# Altium project CW312T_ICE40UP.PrjPcb
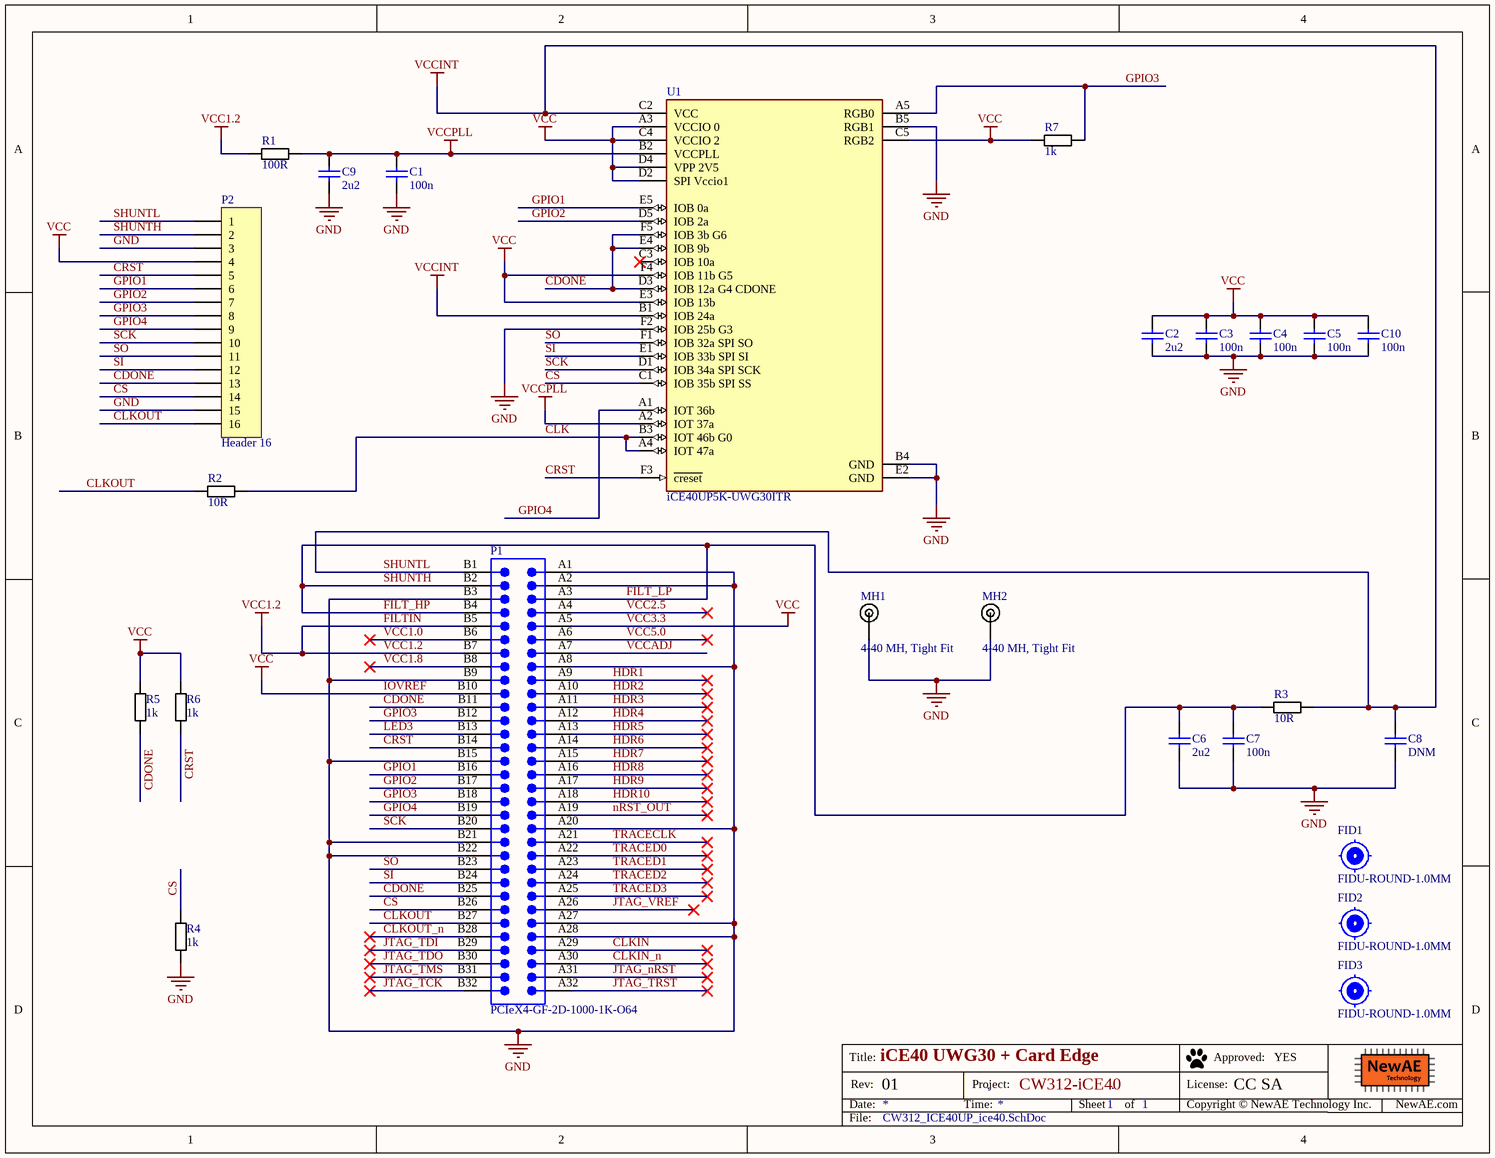
[diagram p0: CW312_ICE40UP_ice40.SchDoc]
PrjLicense: CC SA; PrjName: CW312-iCE40; PrjRev: 01
1 sheet, 25 parts. Net scope: global (net labels, ports and power ports of the same name join across sheets).
Board file: CW312T_ICE40UP.PcbDoc

## Sheet CW312_ICE40UP_ice40.SchDoc: iCE40 UWG30 + Card Edge
size Letter; Organization: NewAE Technology Inc.; Address1: 1083 Queen St., Suite 196; Address2: Halifax; Address3: NS; Address4: Canada B3H 0B2; DocumentNumber: .; Revision: .; SheetNumber: 1; SheetTotal: 1; SheetApproved: YES

### Parts
C1  100n  [CAPC0603_M]
C2  2u2  [CAPC0603_M]
C3  100n  [CAPC0603_M]
C4  100n  [CAPC0603_M]
C5  100n  [CAPC0603_M]
C6  2u2  [CAPC0603_M]
C7  100n  [CAPC0603_M]
C8  DNM  [CAPC0603_M]
C9  2u2  [CAPC0603_M]
C10  100n  [CAPC0603_M]
FID1  FIDU-ROUND-1.0MM  [FIDU-ROUND-1.0mm]  (no BOM)
FID2  FIDU-ROUND-1.0MM  [FIDU-ROUND-1.0mm]  (no BOM)
FID3  FIDU-ROUND-1.0MM  [FIDU-ROUND-1.0mm]  (no BOM)
MH1  4-40 MH, Tight Fit  [MOUNT_#4_TIGHT]
MH2  4-40 MH, Tight Fit  [MOUNT_#4_TIGHT]
P1  PCIeX4-GF-2D-1000-1K-O64  [PCIeX4-GF-2D-1000-1K-O64]  (no BOM)
P2  Header 16  [HDR1X16]
R1  100R  [RESC1608X55N]
R2  10R  [RESC1608X55N]
R3  10R  [RESC1608X55N]
R4  1k  [RESC1608X55N]
R5  1k  [RESC1608X55N]
R6  1k  [RESC1608X55N]
R7  1k  [RESC1608X55N]
U1  iCE40UP5K-UWG30ITR  [FP-WLSC-30-MFG]

### Nets
FILTIN: P1.B5 P1.B7 R1.1  [also labelled VCC1.2]
GND: C1.2 C2.2 C3.2 C4.2 C5.2 C6.2 C7.2 C8.2 C9.2 C10.2 MH1.1 MH2.1 P1.A1 P1.A2 P1.A8 P1.A20 P1.A27 P1.A28 P1.B3 P1.B9 P1.B15 P1.B21 P1.B22 P2.3 P2.15 R4.1 U1.B4(GND) U1.B5(RGB1) U1.E2(GND) U1.F2(IOB_25b_G3)
IOVREF: C2.1 C3.1 C4.1 C5.1 C10.1 P1.A5 P1.B10 P2.4 R5.1 R6.1 R7.2 U1.A3(VCCIO_0) U1.C4(VCCIO_2) U1.C5(RGB2) U1.D2(SPI_Vccio1) U1.D4(VPP_2V5) U1.E3(IOB_13b) U1.F4(IOB_11b_G5)  [also labelled VCC, VCC3.3]
SHUNTL: C8.1 P1.B1 P2.1 R3.2 U1.B1(IOB_24a) U1.C2(VCC)  [also labelled VCCINT]
VCCPLL: C1.1 C9.1 R1.2 U1.A2(IOT_37a) U1.B2(VCCPLL)
CDONE: P1.B11 P1.B25 P2.13 R5.2 U1.D3(IOB_12a_G4_CDONE) U1.E4(IOB_9b) U1.F5(IOB_3b_G6)
CLK: R2.1 U1.A4(IOT_47a) U1.B3(IOT_46b_G0)
CLKIN: P1.A29
CLKIN_n: P1.A30
CLKOUT: P1.B27 P2.16 R2.2
CLKOUT_n: P1.B28
CRST: P1.B14 P2.5 R6.2 U1.F3(~{creset})
CS: P1.B26 P2.14 R4.2 U1.C1(IOB_35b_SPI_SS)
FILT_HP: C6.1 C7.1 P1.A3 P1.B2 P1.B4 P2.2 R3.1  [also labelled FILT_LP, SHUNTH]
GPIO1: P1.B16 P2.6 U1.E5(IOB_0a)
GPIO2: P1.B17 P2.7 U1.D5(IOB_2a)
GPIO3: P1.B12 P1.B18 P2.8 R7.1 U1.A5(RGB0)
GPIO4: P1.B19 P2.9 U1.A1(IOT_36b)
HDR1: P1.A9
HDR2: P1.A10
HDR3: P1.A11
HDR4: P1.A12
HDR5: P1.A13
HDR6: P1.A14
HDR7: P1.A15
HDR8: P1.A16
HDR9: P1.A17
HDR10: P1.A18
JTAG_nRST: P1.A31
JTAG_TCK: P1.B32
JTAG_TDI: P1.B29
JTAG_TDO: P1.B30
JTAG_TMS: P1.B31
JTAG_TRST: P1.A32
JTAG_VREF: P1.A26
LED3: P1.B13
nRST_OUT: P1.A19
SCK: P1.B20 P2.10 U1.D1(IOB_34a_SPI_SCK)
SI: P1.B24 P2.12 U1.E1(IOB_33b_SPI_SI)
SO: P1.B23 P2.11 U1.F1(IOB_32a_SPI_SO)
TRACECLK: P1.A21
TRACED0: P1.A22
TRACED1: P1.A23
TRACED2: P1.A24
TRACED3: P1.A25
VCC1.0: P1.B6
VCC1.8: P1.B8
VCC2.5: P1.A4
VCC5.0: P1.A6
VCCADJ: P1.A7

Not connected (* = marked no-connect by the designer): U1 C3(IOB_10a)*

### Notes on the sheet
- Title:
- Date:
- Rev:
- Time:
- Project:
- Sheet
- of
- License:
- Copyright © NewAE Technology Inc.
- Approved:
- NewAE.com
- File:

### Library data of the parts
C1 C3-C5 C7 C10 = CCHIP-100n-0603: 100n, 0603; Manufacture 1: Kemet; Manufacture Part Number 1: C0603C104K5RACTU; Component Group: Capacitor; Case-EIA: 0603; Case-Metric: 1608; Rated Voltage: 50VDC; Part Number: CCHIP-100n-0603; Footprint: 0603; Pin Count: 2; Supplier 1: Digi-Key; Supplier Part Number 1: 399-5089-2-ND; Value: 100n; Mounting Technology: SMT; Component Kind: Standard; Component Type: Standard
C2 C6 C9 = CCHIP-2u2-0603: 2u2, 0603; Manufacture 1: Samsung; Manufacture Part Number 1: CL10B225KP8NNNC; Component Group: Capacitor; Case-EIA: 0603; Case-Metric: 1608; Rated Voltage: 10VDC; Part Number: CCHIP-2u2-0603; Footprint: 0603; Pin Count: 2; Supplier 1: Digi-Key; Supplier Part Number 1: 1276-1134-1-ND; Value: 2u2; Mounting Technology: SMT; Component Kind: Standard; Component Type: Standard
C8 = CCHIP-DNM-0603: DNM, 0603; Component Group: Capacitor; Case-EIA: 0603; Part Number: CCHIP-DNM-0603; Footprint: 0603; Pin Count: 2; Value: DNM; Mounting Technology: SMT; Component Kind: Standard; Component Type: Standard
FID1-FID3 = FIDU-ROUND-1.0MM: ROUND FIDUCIAL; Component Group: PCB Feature; Part Number: FIDU-ROUND-1.0MM; Pin Count: 0; Component Type: Standard (No BOM)
MH1 MH2 = MOUNT_#4_TIGHT: Machine screw 4-40 Mounting Hole; Component Group: Mechanical; PP Material Stack: 0; Part Number: MOUNT_#4_TIGHT; Pin Count: 1; Component Kind: Mechanical; Component Type: Mechanical; PP Rotation: 0
P1 = CMP-0001-00031-2: Golden finger, PCIeX4, Dual, Opposite, Pitch 1mm, 64-Position; Mating Connector: Molex-87715-9106; Publisher: Altium; ClassName: Edge Connector; Datasheet Version: rev2.0, Apr-2007; Package Reference: PCIeX4-GF-2D-1000-1K-O64
P2 = Header 16: Header, 16-Pin; LatestRevisionDate: 17-Jul-2002; LatestRevisionNote: Re-released for DXP Platform.; Publisher: Altium Limited
R1 = RCHIP-100R-0603: 100R res, 0603, 1%, 1/10W; Manufacture 1: Yageo; Manufacture Part Number 1: RC0603FR-07100RL; Component Group: Resistor; Case-EIA: 0603; Case-Metric: 1608; Rated Power: 0.1W; Rated Voltage: 75VDC; Part Number: RCHIP-100R-0603; Footprint: 0603; Pin Count: 2; Supplier 1: Digi-Key; Supplier Part Number 1: 311-100HRCT-ND; Value: 100R; Tolerance: 1%; Mounting Technology: SMT; Temperature Range: -55C to 155C; Component Kind: Standard; Component Type: Standard
R2 R3 = RCHIP-10R-0603: 10R res, 0603, 1%, 1/10W; Manufacture 1: Yageo; Manufacture Part Number 1: RC0603FR-0710RL; Component Group: Resistor; Case-EIA: 0603; Case-Metric: 1608; Rated Power: 0.1W; Rated Voltage: 75VDC; Part Number: RCHIP-10R-0603; Footprint: 0603; Pin Count: 2; Supplier 1: Digi-Key; Supplier Part Number 1: 311-10.0HRCT-ND; Value: 10R; Tolerance: 1%; Mounting Technology: SMT; Temperature Range: -55C to 155C; Component Kind: Standard; Component Type: Standard
R4-R7 = RCHIP-1K-0603: 1k res, 0603, 1%, 1/10W; Manufacture 1: Yageo; Manufacture Part Number 1: RC0603FR-071KL; Component Group: Resistor; Case-EIA: 0603; Case-Metric: 1608; Rated Power: 0.1W; Rated Voltage: 75VDC; Part Number: RCHIP-1K-0603; Footprint: 0603; Pin Count: 2; Supplier 1: Digi-Key; Supplier Part Number 1: 311-1.00KHRCT-ND; Value: 1k; Tolerance: 1%; Mounting Technology: SMT; Temperature Range: -55C to 155C; Component Kind: Standard; Component Type: Standard
U1 = CMP-17932-000002-1: CE40-ULTRAPLUS, 5280 LUTS, 1.2V; Manufacturer: Lattice Semiconductor; Frequency: 185MHz; Max Junction Temp: +100°C; Propagation Delay: 9ns; Min Supply Voltage: 1.14V; Standoff Height: 0.14mm; Number Of I/Os: 21; Ram Size: 1024Kbits; Number Of Logic Blocks: 660; Max Supply Voltage: 3.46V; Number Of Logic Elements Cells: 5280; ComponentLink2URL: http://www.latticesemi.com/view_document?document_id=51968; Manufacturer Part Number: iCE40UP5K-UWG30ITR; Device Class L2: Embedded Processors and Controllers; Automotive: No; Octopart: https://octopart.com/ice40up5k-uwg30itr-lattice+semiconductor-75367085; Category: IC; Ipc Land Pattern Name: BGA30N40P5X6_253X211X60; Device Class L3: FPGAs - Field Programmable Gate Arrays; Device Class L1: Integrated Circuits (ICs); Digikey Description: CE40-ULTRAPLUS, 5280 LUTS, 1.2V; Temperature: -40°C to +100°C; Temperature Range Low: -40°C; Lead Free: Yes; Footprint Url: http://www.latticesemi.com/view_document?document_id=213; Height: 0.6mm; Temperature Range High: +100°C; Package: WLSC-30; RoHS: TRUE; ComponentLink2Description: Datasheet